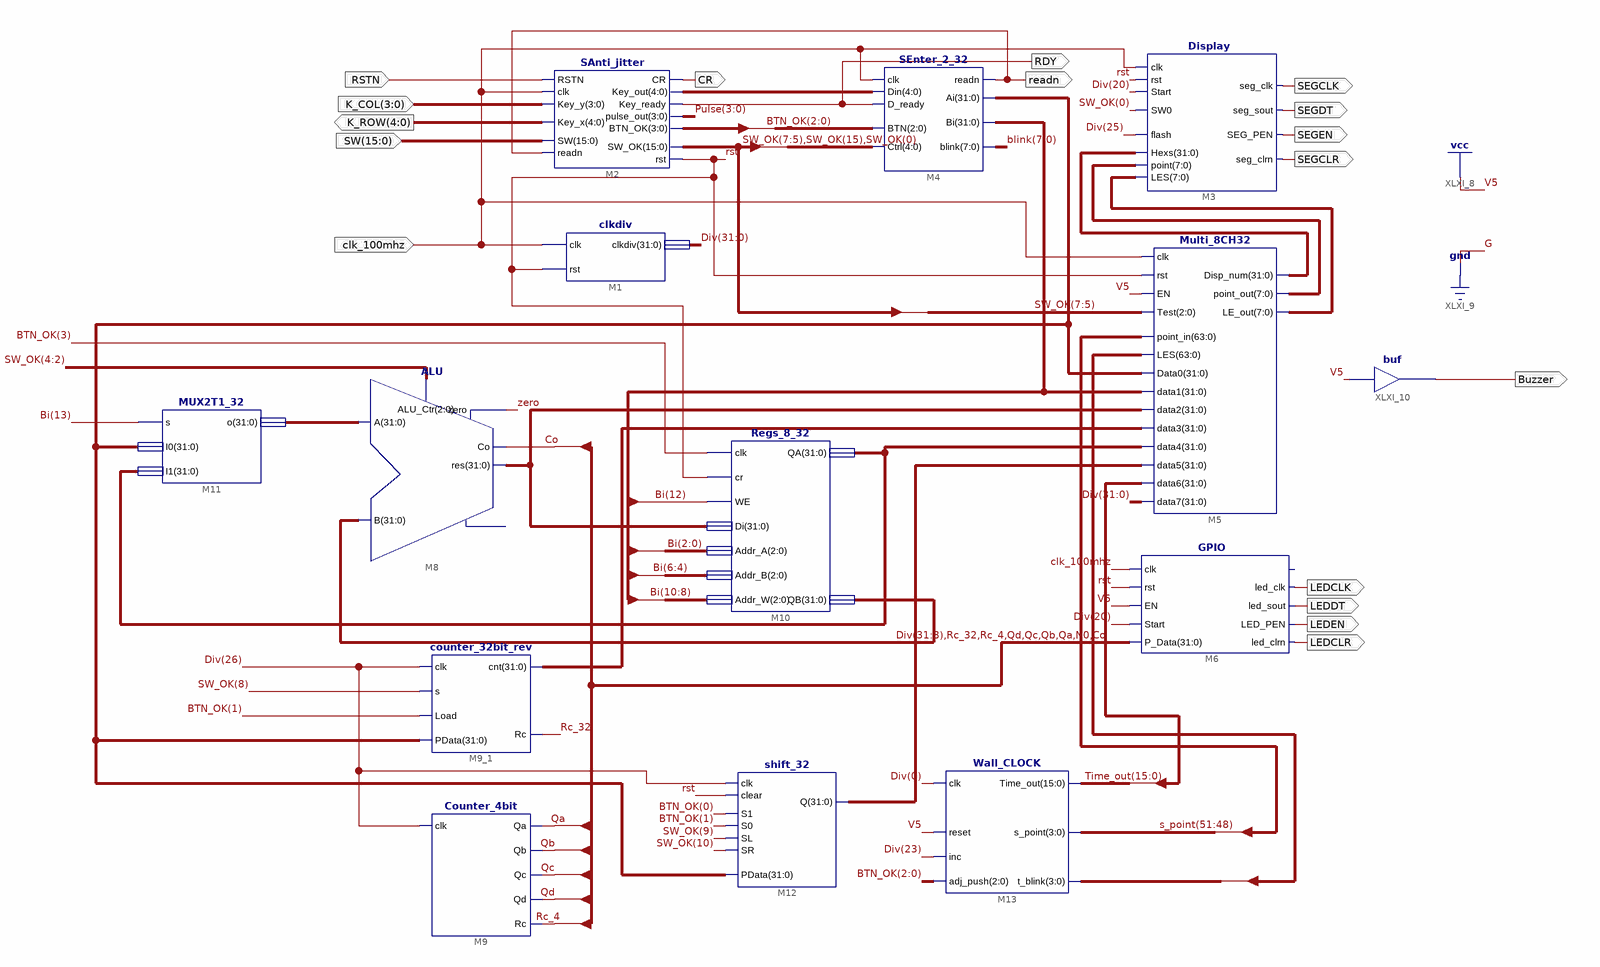
[diagram p0: schematic sheet 1]
// Xilinx ISE schematic Top.sch (kintex7) as structural Verilog: 14 symbols, 17 ports
module Top (
  input  [3:0] K_COL,
  input  [15:0] SW,
  input  RSTN,
  input  clk_100mhz,
  output [4:0] K_ROW,
  output CR,
  output RDY,
  output readn,
  output SEGCLK,
  output SEGDT,
  output SEGEN,
  output SEGCLR,
  output Buzzer,
  output LEDCLK,
  output LEDDT,
  output LEDEN,
  output LEDCLR
);

  wire Co, N0, Qa, Qb, Qc, Qd, Rc_4, Rc_32, rst, zero;
  wire [3:0] BTN_OK, Pulse;
  wire [4:0] XLXN_9;
  wire [7:0] blink, XLXN_23, XLXN_24;
  wire [15:0] SW_OK;
  wire [31:0] Bi, Div, Time_out, XLXN_22, XLXN_26, XLXN_27, XLXN_59, XLXN_62, XLXN_70, XLXN_74, XLXN_79;
  wire [63:0] s_point, t_blink;

  SAnti_jitter M2 (
    .SW(SW), .readn(readn), .Key_y(K_COL), .Key_x(K_ROW), .RSTN(RSTN), .clk(clk_100mhz), .Key_out(XLXN_9),
    .Key_ready(RDY), .CR(CR), .rst(rst), .SW_OK(SW_OK), .pulse_out(Pulse), .BTN_OK(BTN_OK));
  SEnter_2_32 M4 (
    .readn(readn), .Ai(XLXN_62), .Bi(Bi), .blink(blink), .Din(XLXN_9), .D_ready(RDY), .clk(clk_100mhz),
    .Ctrl({SW_OK[7:5], SW_OK[15], SW_OK[0]}), .BTN(BTN_OK[2:0]));
  Display M3 (
    .LES(XLXN_24), .SEG_PEN(SEGEN), .seg_sout(SEGDT), .seg_clrn(SEGCLR), .point(XLXN_23), .Hexs(XLXN_22),
    .SW0(SW_OK[0]), .flash(Div[25]), .seg_clk(SEGCLK), .clk(clk_100mhz), .rst(rst), .Start(Div[20]));
  Multi_8CH32 M5 (
    .Test(SW_OK[7:5]), .point_in(s_point), .EN(1'b1), .clk(clk_100mhz), .rst(rst), .LES(t_blink),
    .Data0(XLXN_62), .data1(Bi), .data2(XLXN_70), .data3(XLXN_26), .data4(XLXN_74), .data5(XLXN_27),
    .data6(Time_out), .data7(Div), .point_out(XLXN_23), .LE_out(XLXN_24), .Disp_num(XLXN_22));
  buf XLXI_10 (Buzzer, 1'b1);
  GPIO M6 (
    .clk(clk_100mhz), .P_Data({Div[31:8], Rc_32, Rc_4, Qd, Qc, Qb, Qa, N0, Co}), .rst(rst), .EN(1'b1),
    .Start(Div[20]), .led_clrn(LEDCLR), .led_clk(LEDCLK), .led_sout(LEDDT), .LED_PEN(LEDEN));  // open: GPIOf0
  clkdiv M1 (.clk(clk_100mhz), .rst(rst), .clkdiv(Div));
  ALU M8 (.A(XLXN_59), .B(XLXN_79), .res(XLXN_70), .zero(zero), .Co(Co), .ALU_Ctr(SW_OK[4:2]));  // open: overflow
  Counter_4bit M9 (.clk(Div[26]), .Qa(Qa), .Qb(Qb), .Qc(Qc), .Qd(Qd), .Rc(Rc_4));
  Regs_8_32 M10 (
    .clk(BTN_OK[3]), .cr(rst), .WE(Bi[12]), .Di(XLXN_70), .Addr_A(Bi[2:0]), .Addr_B(Bi[6:4]),
    .Addr_W(Bi[10:8]), .QA(XLXN_74), .QB(XLXN_79));
  counter_32bit_rev M9_1 (.clk(Div[26]), .s(SW_OK[8]), .Load(BTN_OK[1]), .Rc(Rc_32), .cnt(XLXN_26), .PData(XLXN_62));
  MUX2T1_32 M11 (.s(Bi[13]), .I0(XLXN_62), .I1(XLXN_74), .o(XLXN_59));
  shift_32 M12 (
    .Q(XLXN_27), .PData(XLXN_62), .clk(Div[26]), .clear(rst), .S0(BTN_OK[1]), .S1(BTN_OK[0]), .SL(SW_OK[9]),
    .SR(SW_OK[10]));
  Wall_CLOCK M13 (
    .clk(Div[0]), .reset(1'b1), .inc(Div[23]), .adj_push(BTN_OK[2:0]), .Time_out(Time_out[15:0]),
    .s_point(s_point[51:48]), .t_blink(t_blink[51:48]));
endmodule
